# EAGLE design battery_box (EAGLE 6.4)
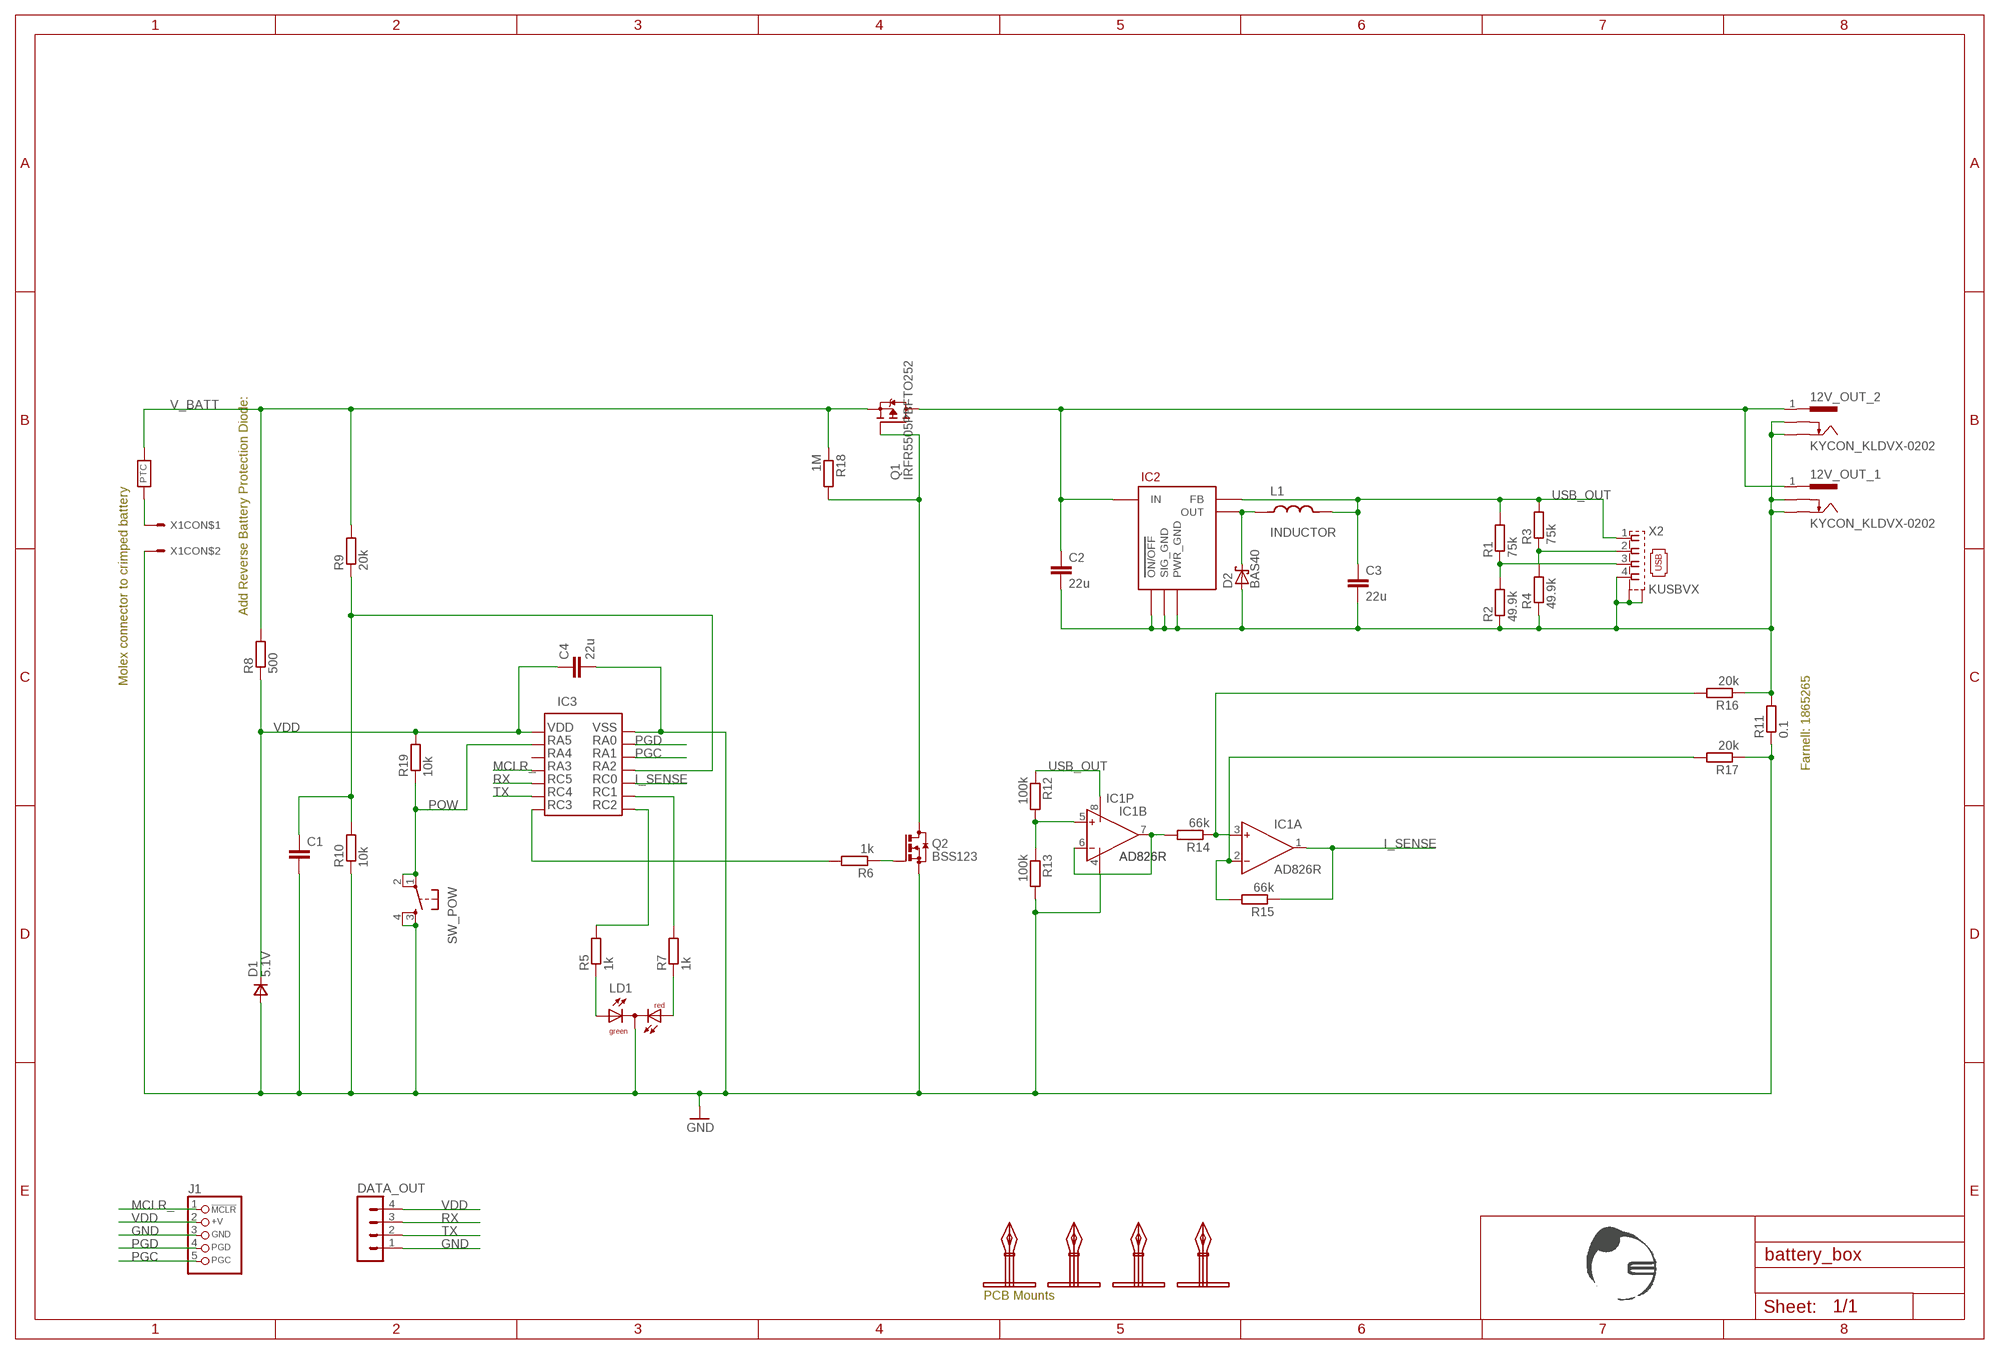
[diagram p0: schematic, sheet 1]

## Parts
12V_OUT_1  KYCON_KLDVX-0202  [KYCON_KLVDX_2020_B]
12V_OUT_2  KYCON_KLDVX-0202  [KYCON_KLVDX_2020_B]
C1  C-EUC0805  [C0805]
C2  22u  C-EUC0805  [C0805]
C3  22u  C-EUC0805  [C0805]
C4  22u  C-EUC0805  [C0805]
D1  5.1V  DSOD323  [SOD323]
D2  BAS40  [SOT23]
DATA_OUT  MA04-1  [MA04-1]
IC1  AD826R  [SO8]
IC2  LM2574  [SO14W]
IC3  PIC16F1824  [SO-14]
J1  CON_HEADER_PRG_PIC_ICSPA  [HEADER_PRG_1X05]
L1  INDUCTOR  [SMD_INDUCTOR]
LD1  DUOLED-RG-C  [DUOLED-C-5MM]
Q1  IRFR5505PBFTO252  [TO252]
Q2  BSS123  [SOT23]
R1  75k  R-EU_R0805  [R0805]
R2  49.9k  R-EU_R0805  [R0805]
R3  75k  R-EU_R0805  [R0805]
R4  49.9k  R-EU_R0805  [R0805]
R5  1k  R-EU_R0805  [R0805]
R6  1k  R-EU_R0805  [R0805]
R7  1k  R-EU_R0805  [R0805]
R8  500  R-EU_R0805  [R0805]
R9  20k  R-EU_R0805  [R0805]
R10  10k  R-EU_R0805  [R0805]
R11  0.1  R-EU_R2512  [R2512]
R12  100k  R-EU_R0805  [R0805]
R13  100k  R-EU_R0805  [R0805]
R14  66k  R-EU_R0805  [R0805]
R15  66k  R-EU_R0805  [R0805]
R16  20k  R-EU_R0805  [R0805]
R17  20k  R-EU_R0805  [R0805]
R18  1M  R-EU_R0805  [R0805]
R19  10k  R-EU_R0805  [R0805]
SW_POW  TAC_SWITCHPTH  [TACTILE-PTH]
U$1  EQUINOX_LOGO_SMALL  [EQUINOX_LOGO_SMALL]
U$2  PTC  [MINISMDC260F]
U$5  PCB_MOUNT_RICHO  [PCBMOUNT]
U$6  PCB_MOUNT_RICHO  [PCBMOUNT]
U$7  PCB_MOUNT_RICHO  [PCBMOUNT]
U$8  PCB_MOUNT_RICHO  [PCBMOUNT]
X1  CON_MOLEX_39_29_1028  [MOLEX_39_29_1028]
X2  KUSBVX  [KUSBVX]

## Nets
GND [power]: C1.2 C4.2 D1.2(A) DATA_OUT.1 IC1.4(P:V-) IC3.14 J1.3(GND) LD1.C Q2.2(S) R10.1 R11.1 R13.2 R17.1 SW_POW.3 SW_POW.4 X1.P$2
I_SENSE: IC1.1(A:OUT) IC3.10 R15.1
MCLR_: IC3.4 J1.1(/MCLR)
N$1 [power]: 12V_OUT_1.1(PAD1) 12V_OUT_2.1(PAD1) C2.1 IC2.10(IN) Q1.3(D)
N$2: LD1.AR R7.1
N$3: R1.1 R2.2 X2.3
N$4: LD1.AX(AG) R5.1
N$5: R3.1 R4.2 X2.2
N$6: U$2.P$1 X1.P$1
N$7: IC3.9 R7.2
N$8: C1.1 IC3.11 R9.1 R10.2
N$9: D2.3(C) IC2.12(OUT) L1.P$1
N$10: IC3.8 R5.2
N$11: Q1.1(G) Q2.3(D) R18.2
N$12: Q2.1(G) R6.1
N$14: IC3.7 R6.2
N$15: IC1.3(A:IN+) R14.1 R16.2
N$16: IC1.2(A:IN-) R15.2 R17.2
N$17: IC1.5(B:IN+) R12.2 R13.1
N$19: IC1.6(B:IN-) IC1.7(B:OUT) R14.2
N$20 [power]: 12V_OUT_1.2(PAD2) 12V_OUT_1.3(PAD3) 12V_OUT_2.2(PAD2) 12V_OUT_2.3(PAD3) C2.2 C3.2 D2.1(A) IC2.4(SIG_GND) IC2.5(ON/OFF) IC2.6(PWR_GND) R2.1 R4.1 R11.2 R16.1 X2.4 X2.M1(S1) X2.M2(S2)
PGC: IC3.12 J1.5(PGC)
PGD: IC3.13 J1.4(PGD)
POW: IC3.2 R19.1 SW_POW.1 SW_POW.2
RX: DATA_OUT.3 IC3.5
TX: DATA_OUT.2 IC3.6
USB_OUT: C3.1 IC1.8(P:V+) IC2.3(FB) L1.P$2 R1.2 R3.2 R12.1 X2.1
V_BATT [power]: Q1.2(S) R8.2 R9.2 R18.1 U$2.P$2
VDD: C4.1 D1.1(C) DATA_OUT.4 IC3.1 J1.2(+V) R8.1 R19.2
Unconnected: IC3.3

## Notes on the sheet
- Molex connector to crimped battery
- Add Reverse Battery Protection Diode:
- Farnell: 1865265
- PCB Mounts

## Library data of the parts
12V_OUT_1 12V_OUT_2 = equinox:KYCON_KLDVX-0202
C1-C4 = rcl:C-EU: CAPACITOR, European symbol
D1 = zetex:D: DIODE; MPN: CDSOD323-T05C; OC_FARNELL: 1824860; OC_NEWARK: 79R6078
D2 = diode:BAS40: Silicon Schottky Diodes General-purpose diode for high-speed switching
DATA_OUT = con-lstb:MA04-1: PIN HEADER; OC_FARNELL: unknown; OC_NEWARK: unknown
IC1 = analog-devices:AD826: High-Speed, Low-Power Dual Operational Amplifier Source: http://www.analog.com/static/imported-files/data_sheets/AD826.pdf
IC2 = equinox:LM2574
IC3 = equinox:PIC16F1824
J1 = equinox:CON_HEADER_PRG_PIC_ICSP: 5-pin PIC In Circuit Serial Programming header
L1 = equinox:INDUCTOR
LD1 = led:DUOLED-RG-C: DUO LED 2 colors (red/green), 5 mm, round, common Cathode www.ligitek.com or other producers.
Q1 = equinox:IRFR5505PBF
Q2 = transistor-small-signal:BSS123: N-CHANNEL MOS FET
R1-R19 = rcl:R-EU_: RESISTOR, European symbol
SW_POW = SparkFun:TAC_SWITCH: Momentary Switch Button commonly used for reset or general input. Spark Fun Electronics SKU : COM-00097
U$1 = equinox:EQUINOX_LOGO_SMALL
U$2 = equinox:PTC
U$5-U$8 = equinox:PCB_MOUNT_RICHO
X1 = equinox:CON_MOLEX_39_29_1028
X2 = con-kycon:KUSBVX: Vertical,Top Entry Universal Serial Bus Connector KUSBVX Series Source: KYCON Sibalco USB vertical socket KUSBV.pdf

## Net classes
0 default: width 0.381 mm, drill 0.61 mm, clearance 0.381 mm
1 power: width 1.016 mm, drill 0.61 mm, clearance 0.381 mm

## Board
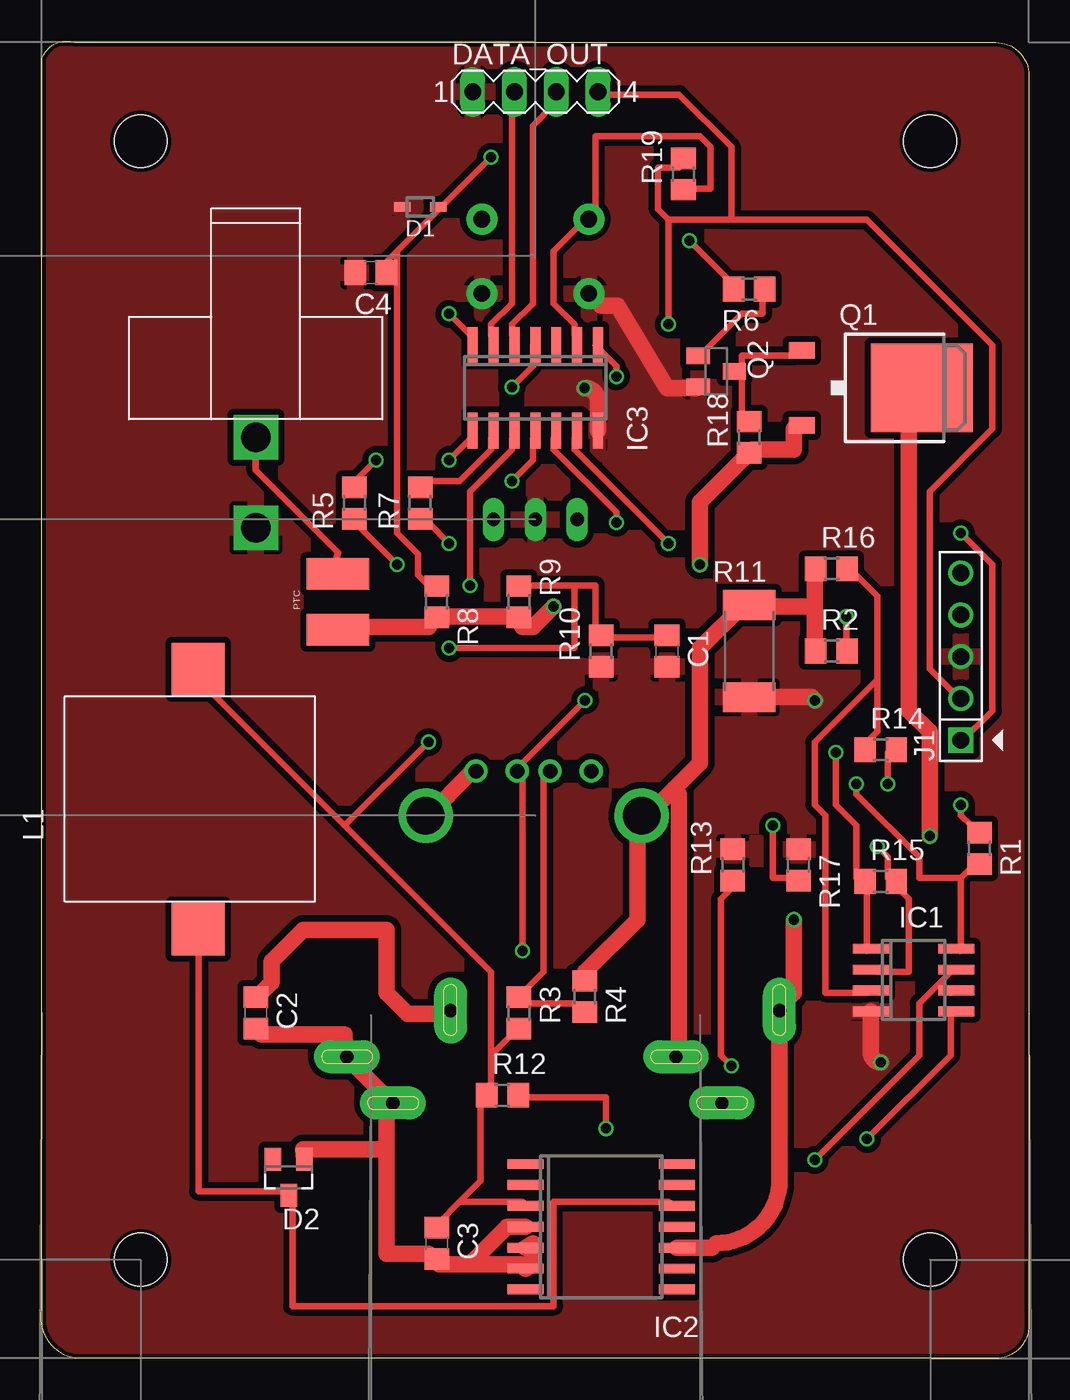
[diagram p1: board, top side]
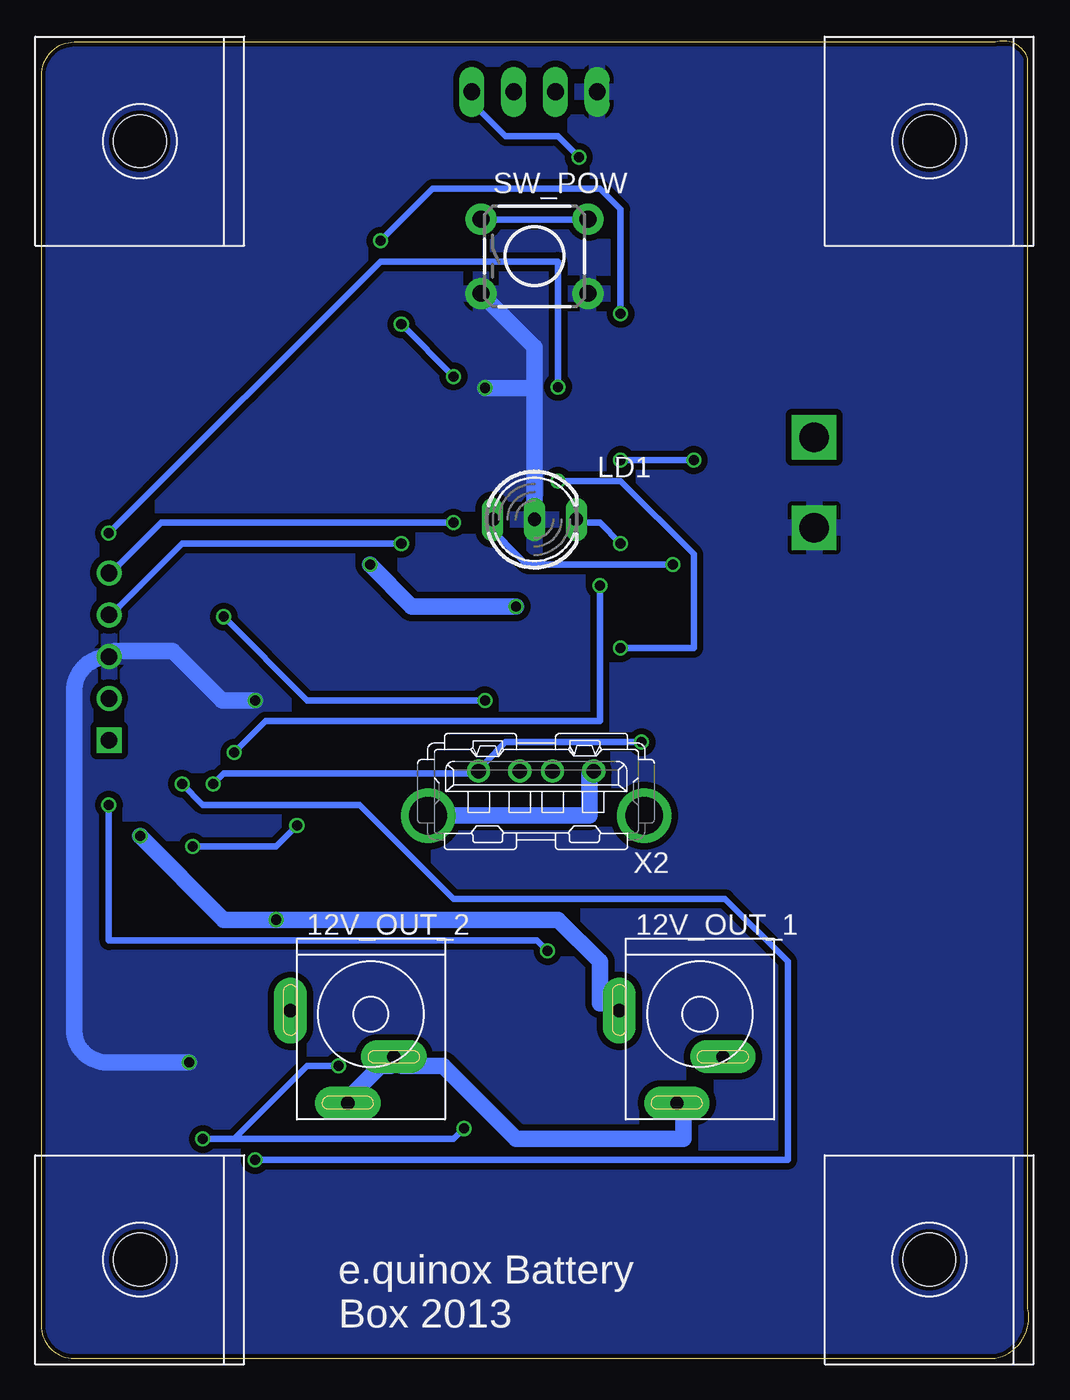
[diagram p2: board, bottom side, seen from below]

Size 60.05 x 80.08 mm. Coordinates in mm from the lower left corner, seen from the top.
Outline: 0.05,3 0.05,79 arc-90 2.05,80 58.05,80 arc-90 60.05,78 60.05,2 arc-90 58.05,0 2.05,0 arc-90 0.05,3
Copper layers (1*16): Top 0.035mm / dielectric 1.5mm / Bottom 0.035mm
Design rules "Seeed_Studio_Rules_2lyr": minimum track width 6mil, minimum drill 12mil, track to track 6mil, track to pad 6mil, pad to pad 6mil, via to via 6mil, smd to smd 0mil, copper to edge 10mil, drill to drill 10mil, minimum pad ring 10mil, minimum via ring 6mil, stop-mask expansion 2mil, vias tented up to drill 100mil, thermal gap 10mil

### Footprints (pad centres in the part's own frame; a part is rotated, then mirrored left to right if it is on the bottom)
KYCON_KLVDX_2020_B = drill 0.813 pad 2 long: 1 -4.845,0.25; 2 -1.345,-5.35; 3 1.455,-2.55
C0805 = smd 1.3 x 1.5: 1 -0.95,0; 2 0.95,0
SOD323 = smd 1 x 0.6: 1 -1.1,0; 2 1.1,0
SOT23 = smd 1 x 1.4: 1 -0.95,-1.1; 2 0.95,-1.1; 3 0,1.1
MA04-1 = drill 1.016 long: 1 -3.81,0; 2 -1.27,0; 3 1.27,0; 4 3.81,0
SO8 = smd 0.6 x 2.2: 1 -1.905,-2.6; 2 -0.635,-2.6; 3 0.635,-2.6; 4 1.905,-2.6; 5 1.905,2.6; 6 0.635,2.6; 7 -0.635,2.6; 8 -1.905,2.6
SO14W = smd 0.6 x 2.2: 1 -3.81,-4.6; 2 -2.54,-4.6; 3 -1.27,-4.6; 4 0,-4.6; 5 1.27,-4.6; 6 2.54,-4.6; 7 3.81,-4.6; 8 3.81,4.6; 9 2.54,4.6; 10 1.27,4.6; 11 0,4.6; 12 -1.27,4.6; 13 -2.54,4.6; 14 -3.81,4.6
SO-14 = smd 0.6 x 2.2: 1 -3.81,-2.6; 2 -2.54,-2.6; 3 -1.27,-2.6; 4 0,-2.6; 5 1.27,-2.6; 6 2.54,-2.6; 7 3.81,-2.6; 8 3.81,2.6; 9 2.54,2.6; 10 1.27,2.6; 11 0,2.6; 12 -1.27,2.6; 13 -2.54,2.6; 14 -3.81,2.6
HEADER_PRG_1X05 = drill 1.016 square: 1 -5.08,0 | drill 1.016: 2 -2.54,0; 3 0,0; 4 2.54,0; 5 5.08,0
SMD_INDUCTOR = smd 3.2 x 3.2: P$1 -7.9,-0.5; P$2 7.9,-0.5
DUOLED-C-5MM = drill 0.813 long: AR 2.54,0; AX -2.54,0; C 0,0
TO252 = smd 1 x 1.6: 1 -2.28,-4.8; 2 2.28,-4.8 | smd 5.4 x 6.2: 3 0,2.5
R0805 = smd 1.3 x 1.5: 1 -0.95,0; 2 0.95,0
R2512 = smd 1.8 x 3.2: 1 -2.8,0; 2 2.8,0
TACTILE-PTH = drill 1.016 pad 1.88: 1 -3.251,2.261; 2 3.251,2.261; 3 -3.251,-2.261; 4 3.251,-2.261
MINISMDC260F = smd 1.93 x 3.81: P$1 1.7,0; P$2 -1.7,0
PCBMOUNT = hole 3.2: 0,0
MOLEX_39_29_1028 = drill 1.8 square: P$1 0,0; P$2 0,5.5
KUSBVX = drill 0.9 pad 1.3: 1 3.5,0; 2 1,0; 3 -1,0; 4 -3.5,0 | drill 2.3 pad 2.8: M1 -6.57,2.71; M2 6.57,2.71

### Placement (x,y rotation side)
12V_OUT_1  20.05,20.88 0 bottom
12V_OUT_2  40.05,20.88 0 bottom
C1  38.05,43 270 top
C2  13.05,21 270 top
C3  24.05,7 270 top
C4  20.05,66 180 top
D1  23.05,70 180 top
D2  15.05,11 180 top
DATA_OUT  30.05,77 0 top
IC1  53.05,23 270 top
IC2  34.05,8 270 top
IC3  30.05,59 180 top
J1  55.92,42.66 90 top
L1  9.05,34 90 top
LD1  30.05,51 0 bottom
Q1  51.05,59 270 top
Q2  41.05,60 270 top
R1  57.05,31 270 top
R2  48.05,43 0 top
R3  29.05,21 270 top
R4  33.05,22 270 top
R5  19.05,52 90 top
R6  43.05,65 180 top
R7  23.05,52 90 top
R8  24.05,46 270 top
R9  29.05,46 270 top
R10  34.05,43 90 top
R11  43.05,43 90 top
R12  28.05,16 0 top
R13  42.05,30 90 top
R14  51.05,37 0 top
R15  51.05,29 0 top
R16  48.05,48 0 top
R17  46.05,30 270 top
R18  43.05,56 90 top
R19  39.05,72 90 top
SW_POW  30.05,67 0 bottom
U$1  47.05,57 0 bottom
U$2  18.05,46 90 top
U$5  54.05,6 0 bottom
U$6  6.05,6 0 bottom
U$7  54.05,74 0 bottom
U$8  6.05,74 0 bottom
X1  13.05,56 180 top
X2  29.95,35.7 180 bottom

### Tracks (layer width: path | path; a pad name or v marks a point on that pad's centre or on a via)
GND  (via drill 0.61)
  Top 1.016: IC3.14 33.86,58.19 arc90 v33.05,59 | R11.1 46.85,40.2 v47.05,40 | IC1.4 50.45,18.6 arc90 v51.05,18 | Q2.2 39.95,59.1 arc-90 39.85,59 38.05,59 35.05,64 34.04,64 SW_POW.3
  Bottom 1.016: LD1.C 30.05,59 | 30.05,59 30.05,61.49 SW_POW.3 | v33.05,59 30.05,59 | v47.05,40 49.05,40 52.05,43 55.58,43 J1.3 arc-90 58.05,40.53 58.05,20 arc-90 56.05,18 v51.05,18
  pour Bottom: 0.05,80 60.05,80 60.05,0 0.05,0
  pour Top: 0.05,80 60.05,80 60.05,0 0.05,0
I_SENSE  (via drill 0.61)
  Top 0.381: IC1.1 50.21,24.77 50.21,28.57 R15.1 49.58,29.21 49.58,32.38 48.31,33.66 v48.31,36.83 | v26.08,46.99 26.08,52.7 28.62,55.24 28.62,55.88 IC3.10
  Bottom 0.381: v26.08,46.99 26.08,38.73 46.4,38.73 v48.31,36.83
MCLR_  (via drill 0.61)
  Top 0.381: v28.62,59.05 29.89,60.33 29.89,61.59 IC3.4 | v55.93,50.16 57.83,48.26 57.83,39.37 55.93,37.47 J1.1
  Bottom 0.381: v28.62,59.05 28.62,66.67 39.42,66.67 v55.93,50.16
N$1  (via drill 0.61)
  Top 1.016: C2.1 13.38,22.23 14.02,22.86 14.02,24.13 15.92,26.04 21,26.04 21,22.23 22.27,20.95 24.81,20.95 12V_OUT_1.1 | v54.02,31.75 54.02,38.1 52.75,39.37 52.75,57.78 53.39,58.42 Q1.3 | v45.77,26.67 45.77,22.23 45.13,21.59 12V_OUT_2.1 44.89,10.85 arc-90 41.05,7 40.78,6.73 IC2.10
  Bottom 1.016: v54.02,31.75 48.94,26.67 v45.77,26.67 28.62,26.67 26.08,24.13 26.08,21.59 25.45,21.59 12V_OUT_1.1
N$2  (via drill 0.61)
  Top 0.381: v24.81,49.53 23.54,50.8 R7.1
  Bottom 0.381: v24.81,49.53 26.08,50.8 27.35,50.8 LD1.AR
N$3  (via drill 0.61)
  Top 0.381: v55.93,33.66 55.93,33.02 56.56,32.38 R1.1 | v29.26,24.77 29.26,35.56 X2.3 29.26,36.2 v33.07,40.01 | v48.94,45.09 48.94,43.18 R2.2
  Bottom 0.381: v55.93,33.66 55.93,25.4 29.89,25.4 v29.26,24.77 | v48.94,45.09 43.86,40.01 v33.07,40.01
N$4  (via drill 0.61)
  Top 0.381: v21.64,48.26 19.1,50.8 R5.1
  Bottom 0.381: v21.64,48.26 30.53,48.26 33.07,50.8 LD1.AX
N$5
  Top 0.381: R4.2 32.43,21.59 29.26,21.59 R3.1 29.26,22.23 30.53,23.5 30.53,35.56 X2.2
N$6
  Top 0.381: X1.P$1 13.05,54 18.05,49 17.83,48.26 U$2.P$1
N$7
  Top 0.381: R7.2 23.54,53.34 25.45,53.34 27.35,55.24 27.35,55.88 IC3.9
N$8  (via drill 0.61)
  Top 0.381: 32.43,46.99 33.7,46.99 33.7,44.45 R10.2 34.34,43.81 37.51,43.81 C1.1 | 32.43,46.99 29.26,46.99 R9.1 | v28.62,53.34 29.89,54.61 29.89,55.88 IC3.11 | v24.81,43.18 32.43,43.18 32.43,46.99
  Bottom 0.381: v28.62,53.34 24.81,53.34 20.37,48.9 20.37,43.18 v24.81,43.18
N$9
  Top 0.381: L1.P$1 9.57,26.04 9.57,10.16 14.65,10.16 D2.3 15.29,9.53 15.29,3.17 31.16,3.17 31.16,9.53 38.15,9.53 IC2.12
N$10  (via drill 0.61)
  Top 0.381: v20.37,54.61 19.1,53.34 R5.2 | v24.81,54.61 26.08,55.88 IC3.8
  Bottom 0.381: v24.81,54.61 v20.37,54.61
N$11
  Top 0.381: R18.2 42.59,57.15 42.59,59.69 Q2.3 42.59,60.33 42.59,60.96 45.77,60.96 Q1.1
N$12
  Top 0.381: Q2.1 40.05,60.96 42.59,63.5 43.86,63.5 43.86,64.77 R6.1
N$14  (via drill 0.61)
  Top 0.381: v39.42,67.94 41.96,65.41 R6.2 | v24.81,63.5 26.08,62.23 IC3.7
  Bottom 0.381: v39.42,67.94 36.24,71.12 26.08,71.12 24.81,69.85 v24.81,63.5
N$15
  Top 0.381: 50.85,41.27 50.85,38.1 50.21,37.47 R14.1 | 50.85,41.27 50.85,46.35 49.58,47.62 R16.2 | 50.85,41.27 47.04,37.47 47.04,33.66 47.67,33.02 47.67,22.23 50.21,22.23 IC1.3
N$16  (via drill 0.61)
  Top 0.381: v44.5,32.38 44.5,29.21 45.77,29.21 R17.2 | v50.85,31.11 51.48,30.48 51.48,29.21 R15.2 52.12,28.57 52.75,27.94 52.75,23.5 50.85,23.5 IC1.2
  Bottom 0.381: v44.5,32.38 45.77,31.11 v50.85,31.11
N$17  (via drill 0.61)
  Top 0.381: v34.34,13.97 34.34,15.88 29.26,15.88 R12.2 | v50.21,13.34 55.29,18.41 55.29,20.95 IC1.5 | v41.96,17.78 41.32,18.41 41.32,27.94 41.96,28.57 R13.1
  Bottom 0.381: v34.34,13.97 34.97,13.34 48.31,13.34 | v50.21,13.34 48.31,13.34 | v41.96,17.78 43.86,17.78 48.31,13.34
N$19  (via drill 0.61)
  Top 0.381: v51.48,34.92 51.48,36.83 R14.2 | v47.04,12.06 53.39,18.41 53.39,21.59 54.66,22.86 | 54.66,22.86 55.29,23.5 IC1.7 | 54.66,22.86 55.29,22.23 IC1.6
  Bottom 0.381: v51.48,34.92 50.21,33.66 40.69,33.66 34.97,27.94 18.46,27.94 14.65,24.13 14.65,12.06 v47.04,12.06
N$20
  Top 1.016: C2.2 13.38,19.68 18.46,19.68 18.46,18.41 12V_OUT_1.3 19.1,17.78 21,15.88 12V_OUT_1.2 21,15.24 21,12.7 | 21,12.7 15.92,12.7 D2.1 | 21,12.7 21,6.35 23.54,6.35 C3.2 24.18,5.71 26.05,5.71 | X2.4 26.08,35.56 23.54,33.02 X2.M1 | 47.04,45.72 47.04,47.62 R16.1 | 47.04,45.72 47.04,43.18 R2.1 | 47.04,45.72 43.23,45.72 R11.2 42.59,45.72 40.05,43.18 40.05,36.2 38.47,34.61 | R4.1 33.07,23.5 36.24,26.67 36.24,32.38 X2.M2 36.88,33.02 38.47,34.61 | 12V_OUT_2.3 38.78,18.41 38.78,34.29 38.47,34.61 | IC2.5 29.89,6.99 29.89,5.71 IC2.6 29.26,5.71 26.05,5.71 | IC2.4 28.33,8 26.05,5.71
  Bottom 1.016: 12V_OUT_2.2 41.32,15.88 39.42,17.78 38.78,17.78 12V_OUT_2.3 38.15,17.78 35.61,17.78 31.16,13.34 21,13.34 21,15.24 12V_OUT_1.2 | X2.4 26.72,35.56 26.72,33.02 36.24,33.02 X2.M2
PGC  (via drill 0.61)
  Top 0.381: v34.97,50.8 34.97,51.44 31.16,55.24 31.16,55.88 IC3.12
  Bottom 0.381: v34.97,50.8 52.75,50.8 55.29,48.26 J1.5
PGD  (via drill 0.61)
  Top 0.381: v38.15,49.53 32.43,55.24 32.43,55.88 IC3.13
  Bottom 0.381: v38.15,49.53 51.48,49.53 55.29,45.72 J1.4
POW
  Top 0.381: R19.1 39.42,71.12 40.69,71.12 40.69,73.66 40.05,74.3 33.7,74.3 33.7,69.85 SW_POW.1 33.07,69.22 31.16,67.31 31.16,64.14 32.43,62.87 32.43,62.23 IC3.2
  Bottom 0.381: SW_POW.2 27.35,69.22 33.07,69.22 SW_POW.1
RX
  Top 0.381: IC3.5 28.62,62.23 28.62,62.87 29.89,64.14 29.89,74.93 31.16,76.2 31.16,76.83 DATA_OUT.3
TX
  Top 0.381: IC3.6 27.35,62.23 27.35,62.87 28.62,64.14 28.62,76.83 DATA_OUT.2
USB_OUT  (via drill 0.61)
  Top 0.381: 55.93,29.21 56.56,29.84 R1.2 | 55.93,29.21 55.93,24.77 IC1.8 | 25.45,9.53 26.72,10.79 26.72,15.88 R12.1 27.35,16.51 27.35,18.41 | 25.45,9.53 24.18,8.26 C3.1 | 27.35,18.41 28.62,19.68 R3.2 | 25.45,9.53 29.26,9.53 IC2.3 | 18.46,32.38 27.35,23.5 27.35,18.41 | 18.46,32.38 9.57,41.27 L1.P$2 | 18.46,32.38 v23.54,37.47 | 55.93,29.21 53.39,29.21 53.39,30.48 49.58,34.29 v49.58,34.92
  Bottom 0.381: v23.54,37.47 31.8,37.47 33.07,36.2 X2.1 33.7,35.56 48.94,35.56 v49.58,34.92
V_BATT  (via drill 0.61)
  Top 1.016: Q1.2 45.77,56.52 45.77,55.24 43.23,55.24 R18.1 42.59,54.61 40.05,52.07 v40.05,48.26 | U$2.P$2 18.46,44.45 23.54,44.45 R8.2 24.18,45.09 28.62,45.09 R9.2 29.26,44.45 29.89,44.45 v31.16,45.72
  Bottom 1.016: v40.05,48.26 37.51,45.72 v31.16,45.72
VDD  (via drill 0.61)
  Top 0.381: 21.64,67.31 21,66.67 21,66.04 C4.1 | 21.64,67.31 24.18,69.85 | 21.64,67.31 21.64,50.16 22.91,48.9 22.91,47.62 23.54,46.99 R8.1 | 38.15,69.22 37.51,69.85 37.51,72.39 38.78,72.39 R19.2 | 41.96,69.22 38.15,69.22 | 41.96,69.22 41.96,73.66 38.78,76.83 34.34,76.83 DATA_OUT.4 | v34.97,59.69 34.97,60.33 33.7,61.59 IC3.1 | 38.15,69.22 v38.15,62.87 | 41.96,69.22 50.21,69.22 57.83,61.59 57.83,56.52 54.02,52.7 54.02,41.91 55.29,40.64 J1.2 | v27.35,73.03 24.18,69.85 | 24.18,69.85 D1.1
  Bottom 0.381: v38.15,62.87 v34.97,59.69 | v27.35,73.03 28.62,74.3 31.8,74.3 34.34,76.83 DATA_OUT.4

### Text on the board
bNames: e.quinox Battery / Box 2013
Document: Cap C2 needs to be closer / to the LM2574